# EAGLE design Bitsy Display Add-On (EAGLE 9.5.1)
COMPANY: ADAFRUIT INDUSTRIES; DRAWN: KTOWN; REV: B
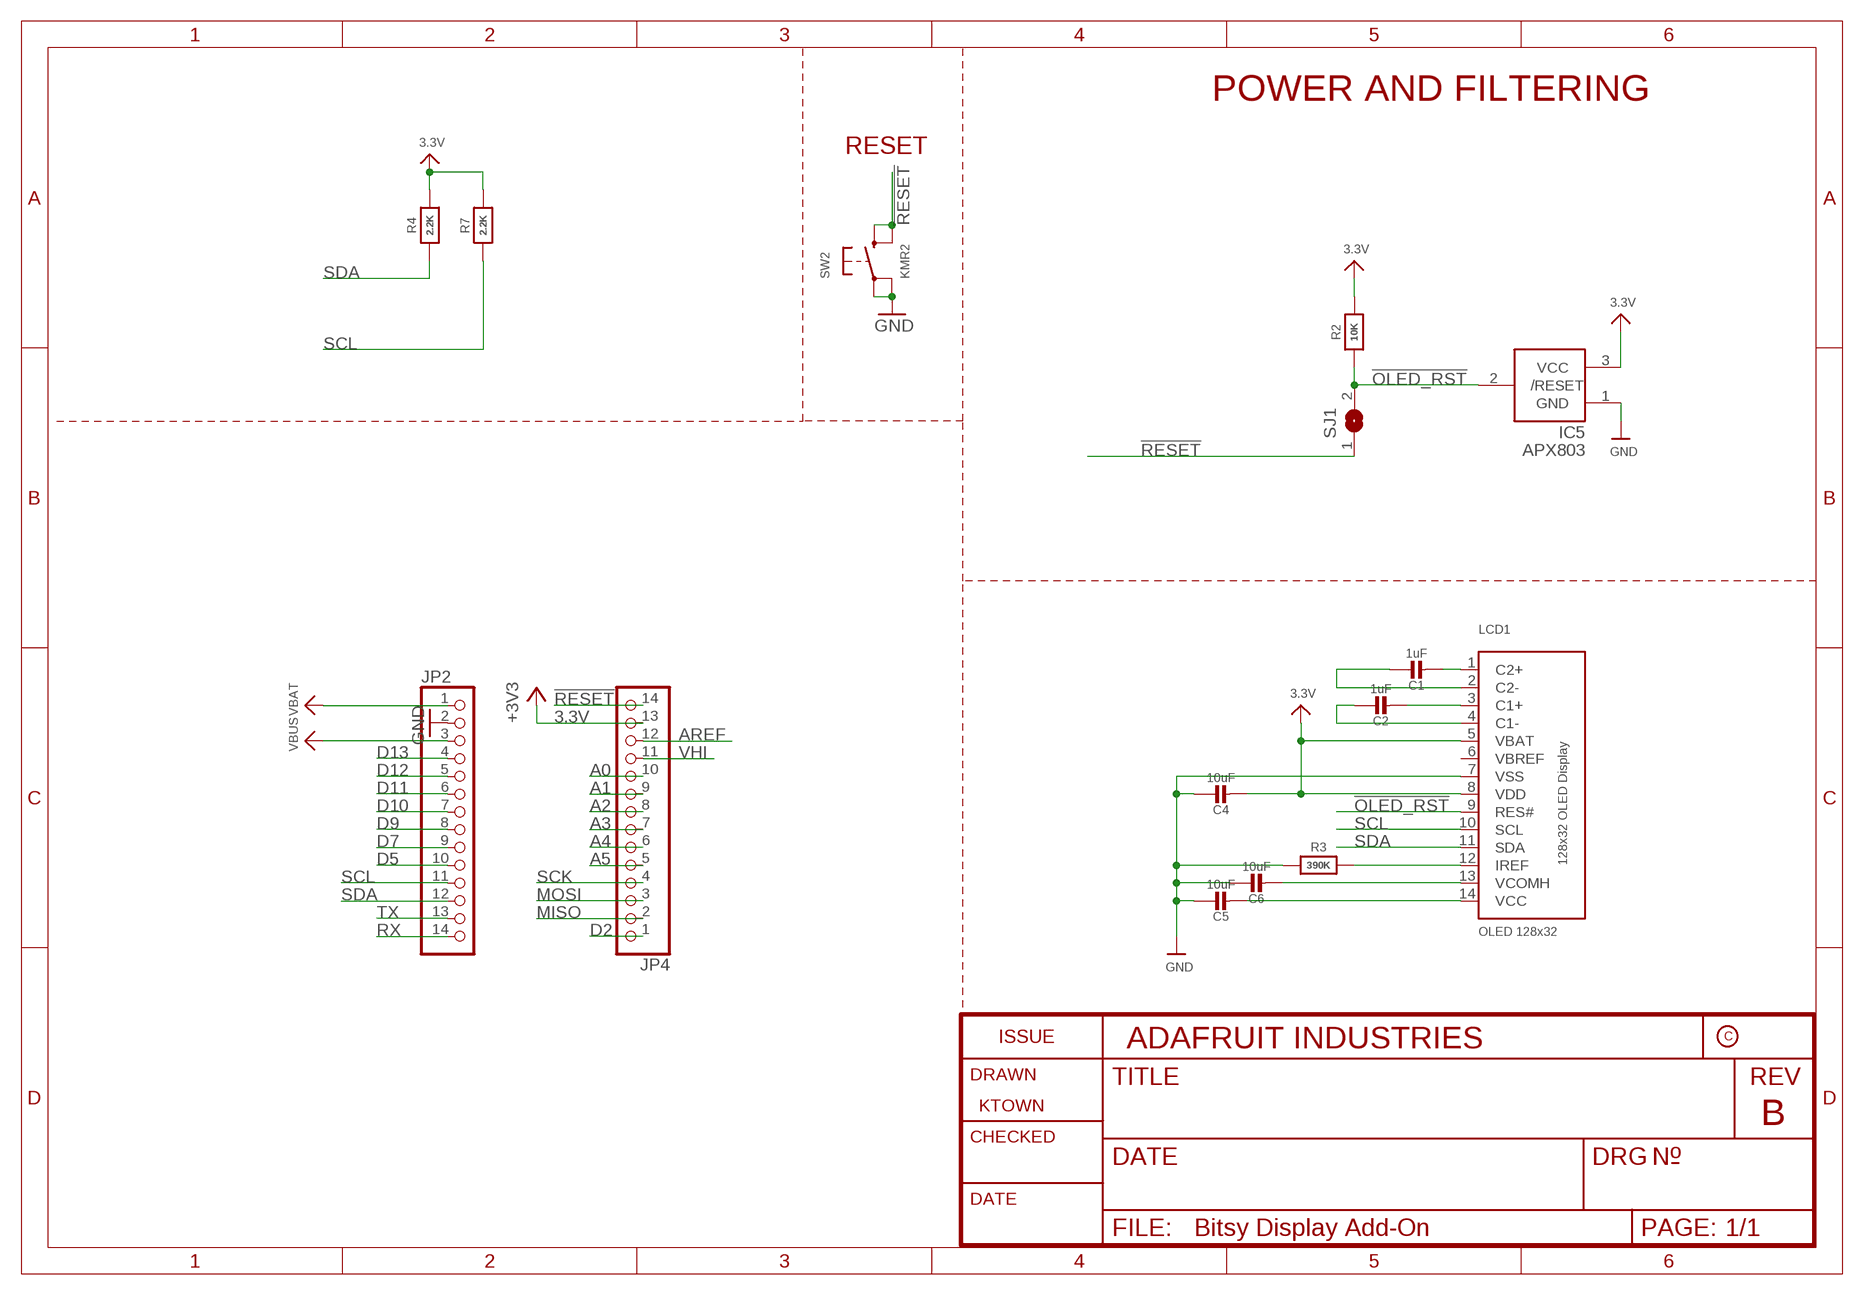
[diagram p0: schematic, sheet 1]

## Parts
C1  1uF  CAP_CERAMIC0805-NOOUTLINE  [0805-NO]
C2  1uF  CAP_CERAMIC0805-NOOUTLINE  [0805-NO]
C4  10uF  CAP_CERAMIC0805-NOOUTLINE  [0805-NO]
C5  10uF  CAP_CERAMIC0805-NOOUTLINE  [0805-NO]
C6  10uF  CAP_CERAMIC0805-NOOUTLINE  [0805-NO]
IC5  APX803  AXP083-SAG  [SOT23]
JP2  HEADER-1X14  [1X14_ROUND70]
JP4  HEADER-1X14  [1X14_ROUND70]
LCD1  OLED 128x32  DISP_OLED_UG-2832HSWEG02  [UG-2832HSWEG02_WRAPUNDER]
R2  10K  RESISTOR_0805MP  [_0805MP]
R3  390K  RESISTOR0805_NOOUTLINE  [0805-NO]
R4  2.2K  RESISTOR0805_NOOUTLINE  [0805-NO]
R7  2.2K  RESISTOR0805_NOOUTLINE  [0805-NO]
SJ1  SOLDERJUMPER  [SOLDERJUMPER_ARROW_NOPASTE]
SW2  KMR2  SWITCH_TACT_SMT4.6X2.8  [BTN_KMR2_4.6X2.8]

## Nets
3.3V: C4.2 IC5.3(VCC) JP4.13 LCD1.5(VBAT) LCD1.8(VDD) R2.2 R4.2 R7.2 ; supply symbol labelled +3V3
!OLED_RST: IC5.2(/RESET) LCD1.9(RES#) R2.1 SJ1.2
!RESET: JP4.14 SJ1.1 SW2.B'(S1) SW2.B(S)
A0: JP4.10
A1: JP4.9
A2: JP4.8
A3: JP4.7
A4: JP4.6
A5: JP4.5
AREF: JP4.12
D2: JP4.1
D5: JP2.10
D7: JP2.9
D9: JP2.8
D10: JP2.7
D11: JP2.6
D12: JP2.5
D13: JP2.4
GND: C4.1 C5.1 C6.1 IC5.1(GND) JP2.2 LCD1.7(VSS) R3.1 SW2.A'(P1) SW2.A(P)
MISO: JP4.2
MOSI: JP4.3
N$1: C1.2 LCD1.1(C2+)
N$2: C1.1 LCD1.2(C2-)
N$3: C2.2 LCD1.3(C1+)
N$4: C2.1 LCD1.4(C1-)
N$5: C6.2 LCD1.13(VCOMH)
N$6: C5.2 LCD1.14(VCC)
N$7: LCD1.12(IREF) R3.2
RX: JP2.14
SCK: JP4.4
SCL: JP2.11 LCD1.10(SCL) R7.1
SDA: JP2.12 LCD1.11(SDA) R4.1
TX: JP2.13
VBAT: JP2.1
VBUS: JP2.3
VHI: JP4.11

## Notes on the sheet
- POWER AND FILTERING
- RESET

## Power pins joined to a net without a drawn wire
VBREF: LCD1.6(VBREF)

## Library data of the parts
C1 C2 C4-C6 = microbuilder:CAP_CERAMIC: Ceramic Capacitors For new designs, use the packages preceded by an '_' character since they are more reliable: The following footprints should be used on most boards: _0402 - Standard footprint for regular board layouts _0603 - Standard footprint for regular board layouts _0805 - Standard footprint for regular board layouts _1206 - Standard footprint for regular board layouts For extremely tight-pitch boards where space is at a premium, the following 'micro-pitch' footprints can be used (smaller pads, no silkscreen outline, etc.): _0402MP - Micro-pitch footprint for very dense/compact boards _0603MP - Micro-pitch footprint for very dense/compact boards _0805MP - Micro-pitch footprint for very dense/compact boards _1206MP - Micro-pitch footprint for very dense/compact boards
IC5 = adafruit:AXP083
JP2 JP4 = microbuilder:HEADER-1X14
LCD1 = microbuilder:DISP_OLED_UG-2832HSWEG02: 128x32 I2C 0.91" Monochrome OLED Display
R2-R4 R7 = microbuilder:RESISTOR: Resistors For new designs, use the packages preceded by an '_' character since they are more reliable: The following footprints should be used on most boards: _0402 - Standard footprint for regular board layouts _0603 - Standard footprint for regular board layouts _0805 - Standard footprint for regular board layouts _1206 - Standard footprint for regular board layouts For extremely tight-pitch boards where space is at a premium, the following 'micro-pitch' footprints can be used (smaller pads, no silkscreen outline, etc.): _0402MP - Micro-pitch footprint for very dense/compact boards _0603MP - Micro-pitch footprint for very dense/compact boards _0805MP - Micro-pitch footprint for very dense/compact boards _1206MP - Micro-pitch footprint for very dense/compact boards
SJ1 = microbuilder:SOLDERJUMPER: SMD Solder JUMPER Solder the two pads together to create a connection, or remove the solder to break it. REFLOW - Use this footprint for solder paste and reflow ovens. WAVE - Use this footprint for hand-soldering (larger pads). CLOSED - Has a trace between the two pads to ensure it is closed by default. The trace needs to be cut to disable the jumper, and can be closed again by creating a solder bridge between the two pads.; BOM: EXCLUDE
SW2 = microbuilder:SWITCH_TACT_SMT: SMT Tact Switches 6x6mm - Digikey: P12940SCT-ND KMR2 (4.6x2.8mm) - Digikey: 401-1426-1-ND EVQ-PQHB55 - Light Touch, 160GF (4.5x4.5mm) - Digikey: P8090SCT-ND KMT0 - KMT021 NGJ LHS (etc.) IP68/Waterproof - Digikey: CKN10289CT-ND

## Board
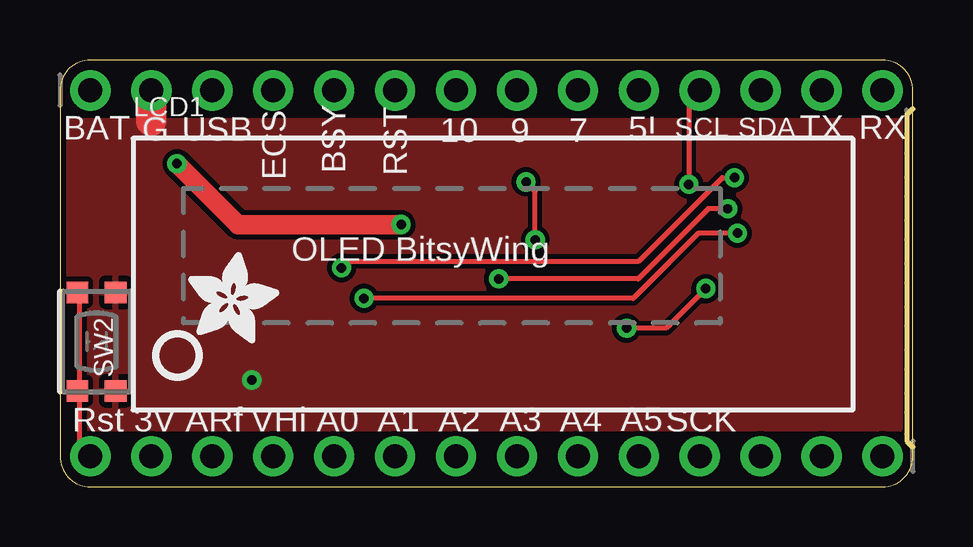
[diagram p1: board, top side]
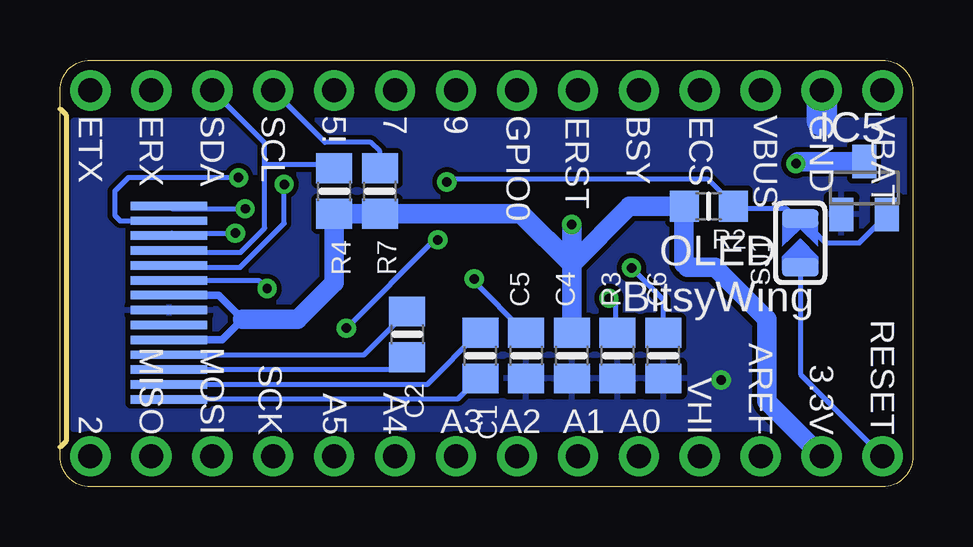
[diagram p2: board, bottom side, seen from below]

Size 35.56 x 17.78 mm. Coordinates in mm from the lower left corner, seen from the top.
Outline: 0,16.51 0,1.27 arc90 1.27,0 34.29,0 arc90 35.56,1.27 35.56,16.51 arc90 34.29,17.78 1.27,17.78 arc90 0,16.51
Copper layers (1*16): Top 0.035mm / dielectric 1.5mm / Bottom 0.035mm
Design rules "adafruit *": minimum track width 8mil, minimum drill 15.5mil, track to track 8mil, track to pad 8mil, pad to pad 8mil, via to via 8mil, smd to smd 8mil, copper to edge 10mil, drill to drill 8mil, minimum pad ring 10mil, minimum via ring 8mil, stop-mask expansion 2mil, vias tented up to drill 20mil, thermal gap 10mil
Milling: 3 lines

### Footprints (pad centres in the part's own frame; a part is rotated, then mirrored left to right if it is on the bottom)
0805-NO = smd 1.24 x 1.5: 1 -0.95,0; 2 0.95,0
SOT23 = smd 1 x 1.4: 1 -0.95,-1.1; 2 0.95,-1.1; 3 0,1.1
1X14_ROUND70 = drill 1 pad 1.676: 1 -16.51,0; 2 -13.97,0; 3 -11.43,0; 4 -8.89,0; 5 -6.35,0; 6 -3.81,0; 7 -1.27,0; 8 1.27,0; 9 3.81,0; 10 6.35,0; 11 8.89,0; 12 11.43,0; 13 13.97,0; 14 16.51,0
UG-2832HSWEG02_WRAPUNDER = smd 3.2 x 0.35 bottom: 1 -2.03,-5.3; 2 -2.03,-4.68; 3 -2.03,-4.06; 4 -2.03,-3.44; 5 -2.03,-2.82; 6 -2.03,-2.2; 7 -2.03,-1.58; 8 -2.03,-0.96; 9 -2.03,-0.34; 10 -2.03,0.28; 11 -2.03,0.9; 12 -2.03,1.52; 13 -2.03,2.14; 14 -2.03,2.76
_0805MP = smd 1.2 x 1.3: 1 -1.016,0; 2 1.016,0
SOLDERJUMPER_ARROW_NOPASTE = smd 0.762 x 1.524: 1 -1.016,0; 2 1.016,0
BTN_KMR2_4.6X2.8 = smd 0.9 x 0.9: A 2.05,0.8; A' -2.05,0.8; B 2.05,-0.8; B' -2.05,-0.8

### Placement (x,y rotation side)
C1  18.03,5.46 270 bottom
C2  21.08,6.35 270 bottom
C4  14.22,5.46 90 bottom
C5  16.13,5.46 90 bottom
C6  10.41,5.46 90 bottom
IC5  2.03,12.45 0 bottom
JP2  17.78,16.51 0 top
JP4  17.78,1.27 180 top
LCD1  33.05,8.94 0 top
R2  8.51,11.68 180 bottom
R3  12.32,5.46 90 bottom
R4  24.13,12.32 270 bottom
R7  22.23,12.32 270 bottom
SJ1  4.7,10.16 90 bottom
SW2  1.52,6.05 270 top
U$6  [PCBFEAT-REV-040]  4.89,5.46 180 top
U$62  [ADAFRUIT_3.5MM]  5.33,5.97 0 top

### Tracks (layer width: path | path; a pad name or v marks a point on that pad's centre or on a via)
3.3V  (via drill 0.39)
  Top 0.813: v4.88,13.46 7.42,10.92 v14.22,10.92
  Bottom 0.203: 9.55,11.58 R2.2 | 22.15,11.38 R7.2
  Bottom 0.305: LCD1.8 28.94,7.98 27.94,6.99 28.8,6.12 LCD1.5
  Bottom 0.813: JP4.13 6.1,3.56 6.1,6.99 8.26,9.14 9.4,9.14 9.55,9.3 9.55,11.58 | R2.2 11.81,11.68 14.22,9.27 | C4.2 14.22,9.27 | 14.22,9.27 16.33,11.38 22.15,11.38 | IC5.3 4.79,13.55 v4.88,13.46 | v14.22,10.92 14.22,9.27 | 27.94,6.99 25.65,6.99 24.13,8.51 R4.2 R7.2
!OLED_RST  (via drill 0.39)
  Top 0.203: v26.92,8.26 25.27,6.6 v23.62,6.6 | v19.81,10.29 19.81,12.32 v19.43,12.7
  Bottom 0.203: IC5.2 1.22,11.18 2.23,10.16 3.66,10.16 4.67,11.18 SJ1.2 4.88,11.18 5.28,11.58 7.32,11.58 R2.1 7.52,11.79 8.53,12.8 19.33,12.8 v19.43,12.7 | LCD1.9 27.27,8.6 v26.92,8.26 | v23.62,6.6 19.94,10.29 v19.81,10.29
!RESET
  Top 0.203: JP4.14 1.22,1.42 0.81,1.83 0.81,3.86 SW2.B 0.81,4.06 0.81,7.92 SW2.B'
  Bottom 0.203: JP4.14 4.67,4.67 4.67,9.14 SJ1.1
GND  (via drill 0.39)
  Top 1.27: JP2.2 3.81,15.24
  Bottom 1.27: JP2.2 3.81,15.24
  other vias: 8,4.45
  pour Bottom: 0,15.24 35,15.24 35,2.41 0,2.41
  pour Top: 0.25,15.24 35,15.24 35,2.41 0.25,2.41
N$1
  Bottom 0.203: C1.2 18.15,4.49 18.97,3.66 30.89,3.66 LCD1.1
N$2
  Bottom 0.203: C1.1 18.05,6.43 18.09,6.43 20.24,4.27 30.89,4.27 LCD1.2
N$3
  Bottom 0.203: LCD1.3 30.89,4.88 21.61,4.88 C2.2
N$4
  Bottom 0.203: LCD1.4 31.09,5.49 22.9,5.49 C2.1
N$5  (via drill 0.39)
  Top 0.203: v11.73,9.12 12.01,9.4 24.13,9.4 27.61,12.88 v28.12,12.88
  Bottom 0.203: C6.2 10.41,7.8 v11.73,9.12 | v28.12,12.88 32.72,12.88 33.27,12.32 33.27,11.3 33.05,11.08 LCD1.13
N$6  (via drill 0.39)
  Top 0.203: v18.29,8.66 24.11,8.66 27.03,11.58 v27.84,11.58
  Bottom 0.203: v18.29,8.66 18.29,8.53 16.26,6.5 C5.2 | v27.84,11.58 30.89,11.58 LCD1.14
N$7  (via drill 0.39)
  Top 0.203: v12.68,7.85 23.9,7.85 26.62,10.57 v28.25,10.57
  Bottom 0.203: v12.68,7.85 12.39,7.57 12.39,6.5 R3.2 | v28.25,10.57 30.89,10.57 LCD1.12
SCL  (via drill 0.39)
  Top 0.203: JP2.11 26.21,16.05 v26.21,12.6
  Bottom 0.203: v26.21,12.6 26.21,10.97 28.04,9.14 30.89,9.14 LCD1.10 | R7.1 22.23,13.97 22.61,14.35 24.51,14.35 JP2.11
SDA
  Bottom 0.203: R4.1 24.18,13.41 27.03,13.41 | LCD1.11 30.89,9.75 28.04,9.75 27.03,10.77 27.03,13.41 | JP2.12 27.03,14.33 27.03,13.41

### Text on the board
tPlace: BAT | G | USB | 10 | 9 | 7 | 5! | SCL | SDA | TX | RX | ECS | BSY | RST | OLED BitsyWing | Rst | 3V | ARf | VHi | A0 | A1 | A2 | A3 | A4 | A5 | SCK
bPlace: VBAT | GND | VBUS | ECS | BSY | ERST | GPIO0 | 9 | 7 | 5! | SCL | SDA | ERX | ETX | OLED / BitsyWing | A0 | A1 | A2 | A3 | RESET | 3.3V | AREF | VHI | A4 | A5 | SCK | MOSI | MISO | 2
Reference: LiPo Backpack